# Altium schematic sheet Keyfinder_Alert.SchDoc: Keyfinder Alert
size A4; DrawnBy: M. Schwegler; Organization: HSLU T&A; Address1: Abteilung Elektrotechnik; Address2: Technikumsstrasse 21; Address3: CH-6048 Horw; Revision: v2; SheetNumber: 4; SheetTotal: 4; Projektname: SmartBoard; DocumentName: Keyfinder; ProjectName: SmartBoard
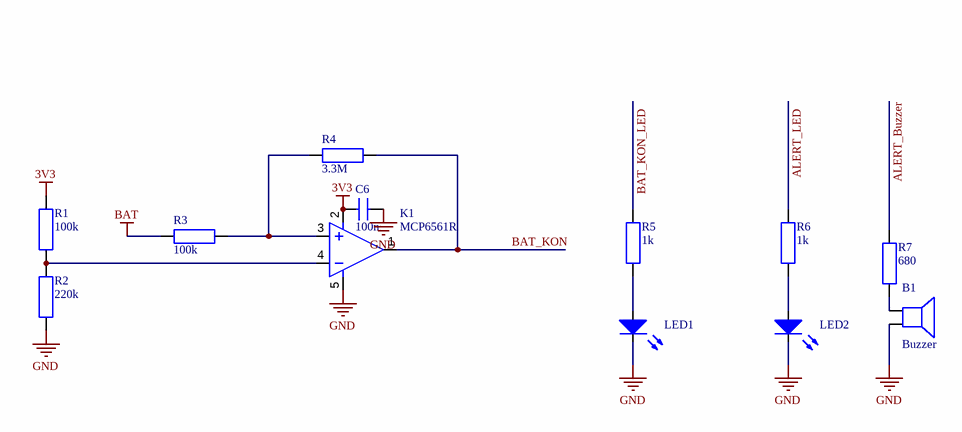
[diagram p0: Keyfinder_Alert.SchDoc]

## Parts
B1  Buzzer  [piezo_ele]
C6  100n  [0805_C]
K1  MCP6561R  [SOT23-5]
LED1  (no value)  [0805_LED]
LED2  (no value)  [0805_LED]
R1  100k  [0805_R]
R2  220k  [0805_R]
R3  100k  [0805_R]
R4  3.3M  [0805_R]
R5  1k  [0805_R]
R6  1k  [0805_R]
R7  680  [0805_R]

## Nets
3V3: C6.2 K1.2 R1.1
BAT: R3.2
GND: B1.2 C6.1 K1.5 LED1.2(K) LED2.2(K) R2.2
ALERT_Buzzer: R7.1
ALERT_LED: R6.1
BAT_KON: K1.1 R4.1
BAT_KON_LED: R5.1
NetB1_1: B1.1 R7.2
NetK1_3: K1.3 R3.1 R4.2
NetK1_4: K1.4 R1.2 R2.1
NetLED1_1: LED1.1(A) R5.2
NetLED2_1: LED2.1(A) R6.2

## Notes on the sheet
- Project:
- Drawn by:
- Size:
- Sheet
- A4
- Rev.:
- of
- Date:
- File:

## Library data of the parts
B1 = SPEAKER
C6 = C?: Normaler Kondensator
K1 = OPAMP
LED1 LED2 = LED
R1-R7 = R?: Normaler Widerstand